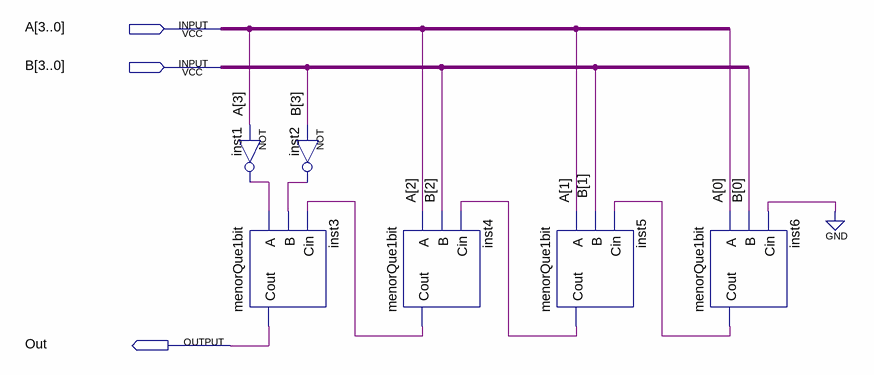
[diagram p0: schematic sheet]
// Quartus schematic menorQue4bits.bdf as structural Verilog: 6 symbols, 3 pins
module menorQue4bits (
  input  [3:0] A,
  input  [3:0] B,
  output Out
);

  wire inst1_out, inst2_out, inst4_cout, inst5_cout, inst6_cout;

  not inst1 (inst1_out, A[3]);
  menorQue1bit inst3 (.A(inst1_out), .B(inst2_out), .Cin(inst4_cout), .Cout(Out));
  not inst2 (inst2_out, B[3]);
  menorQue1bit inst4 (.A(A[2]), .B(B[2]), .Cin(inst5_cout), .Cout(inst4_cout));
  menorQue1bit inst5 (.A(A[1]), .B(B[1]), .Cin(inst6_cout), .Cout(inst5_cout));
  menorQue1bit inst6 (.A(A[0]), .B(B[0]), .Cin(1'b0), .Cout(inst6_cout));
endmodule
